# Altium schematic sheet tailLite.SchDoc
size 584 x 635 mm; SheetNumber: 1; SheetTotal: 1; ENG_APP_DATE: --/--/--; DSN_APP_DATE: --/--/--; CHK_APP_DATE: --/--/--
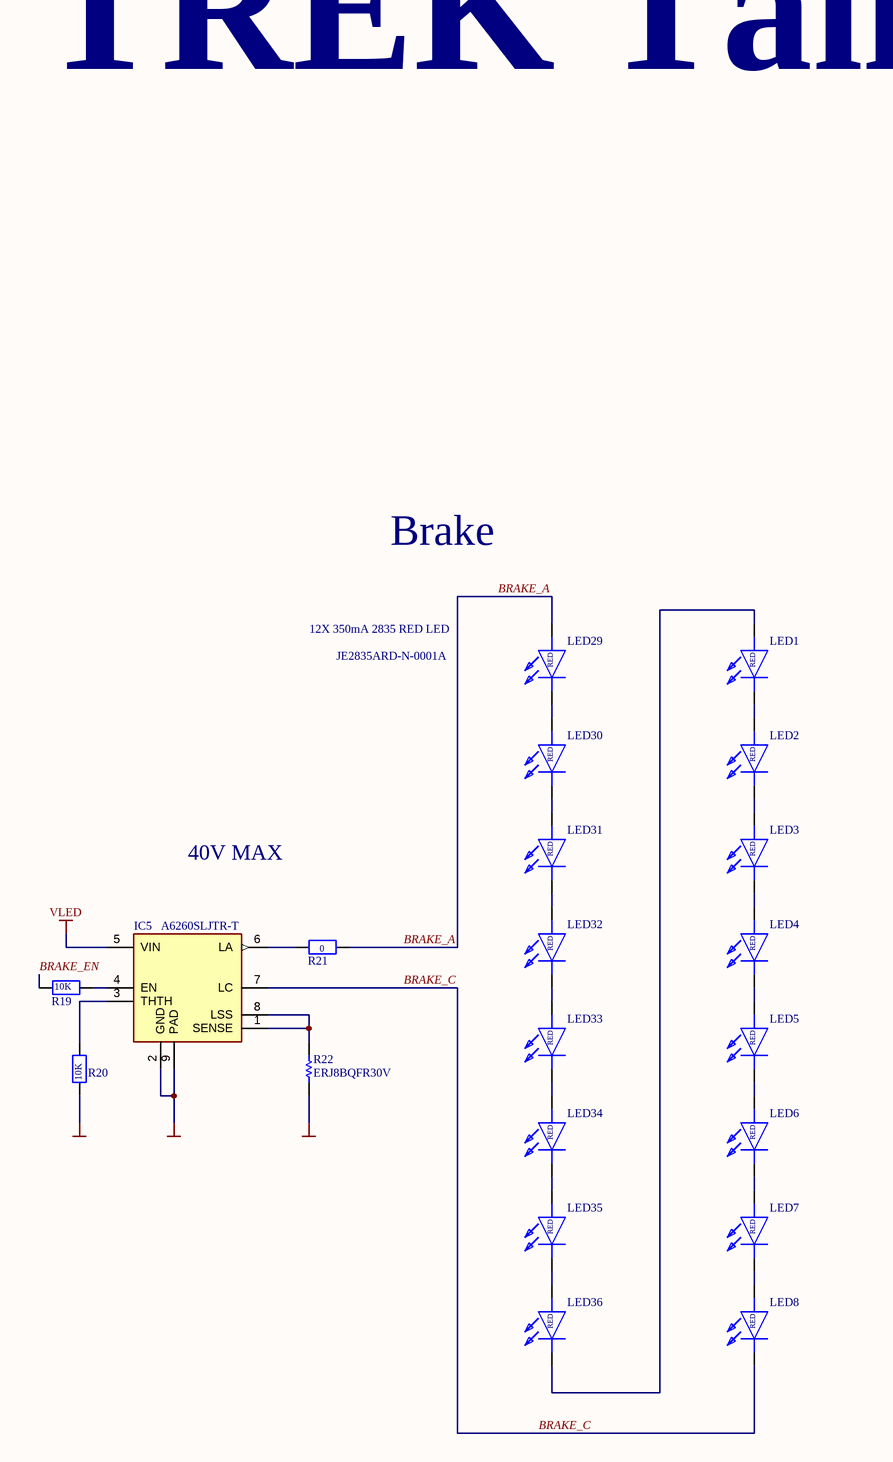
[diagram p0: tailLite.SchDoc, top left]
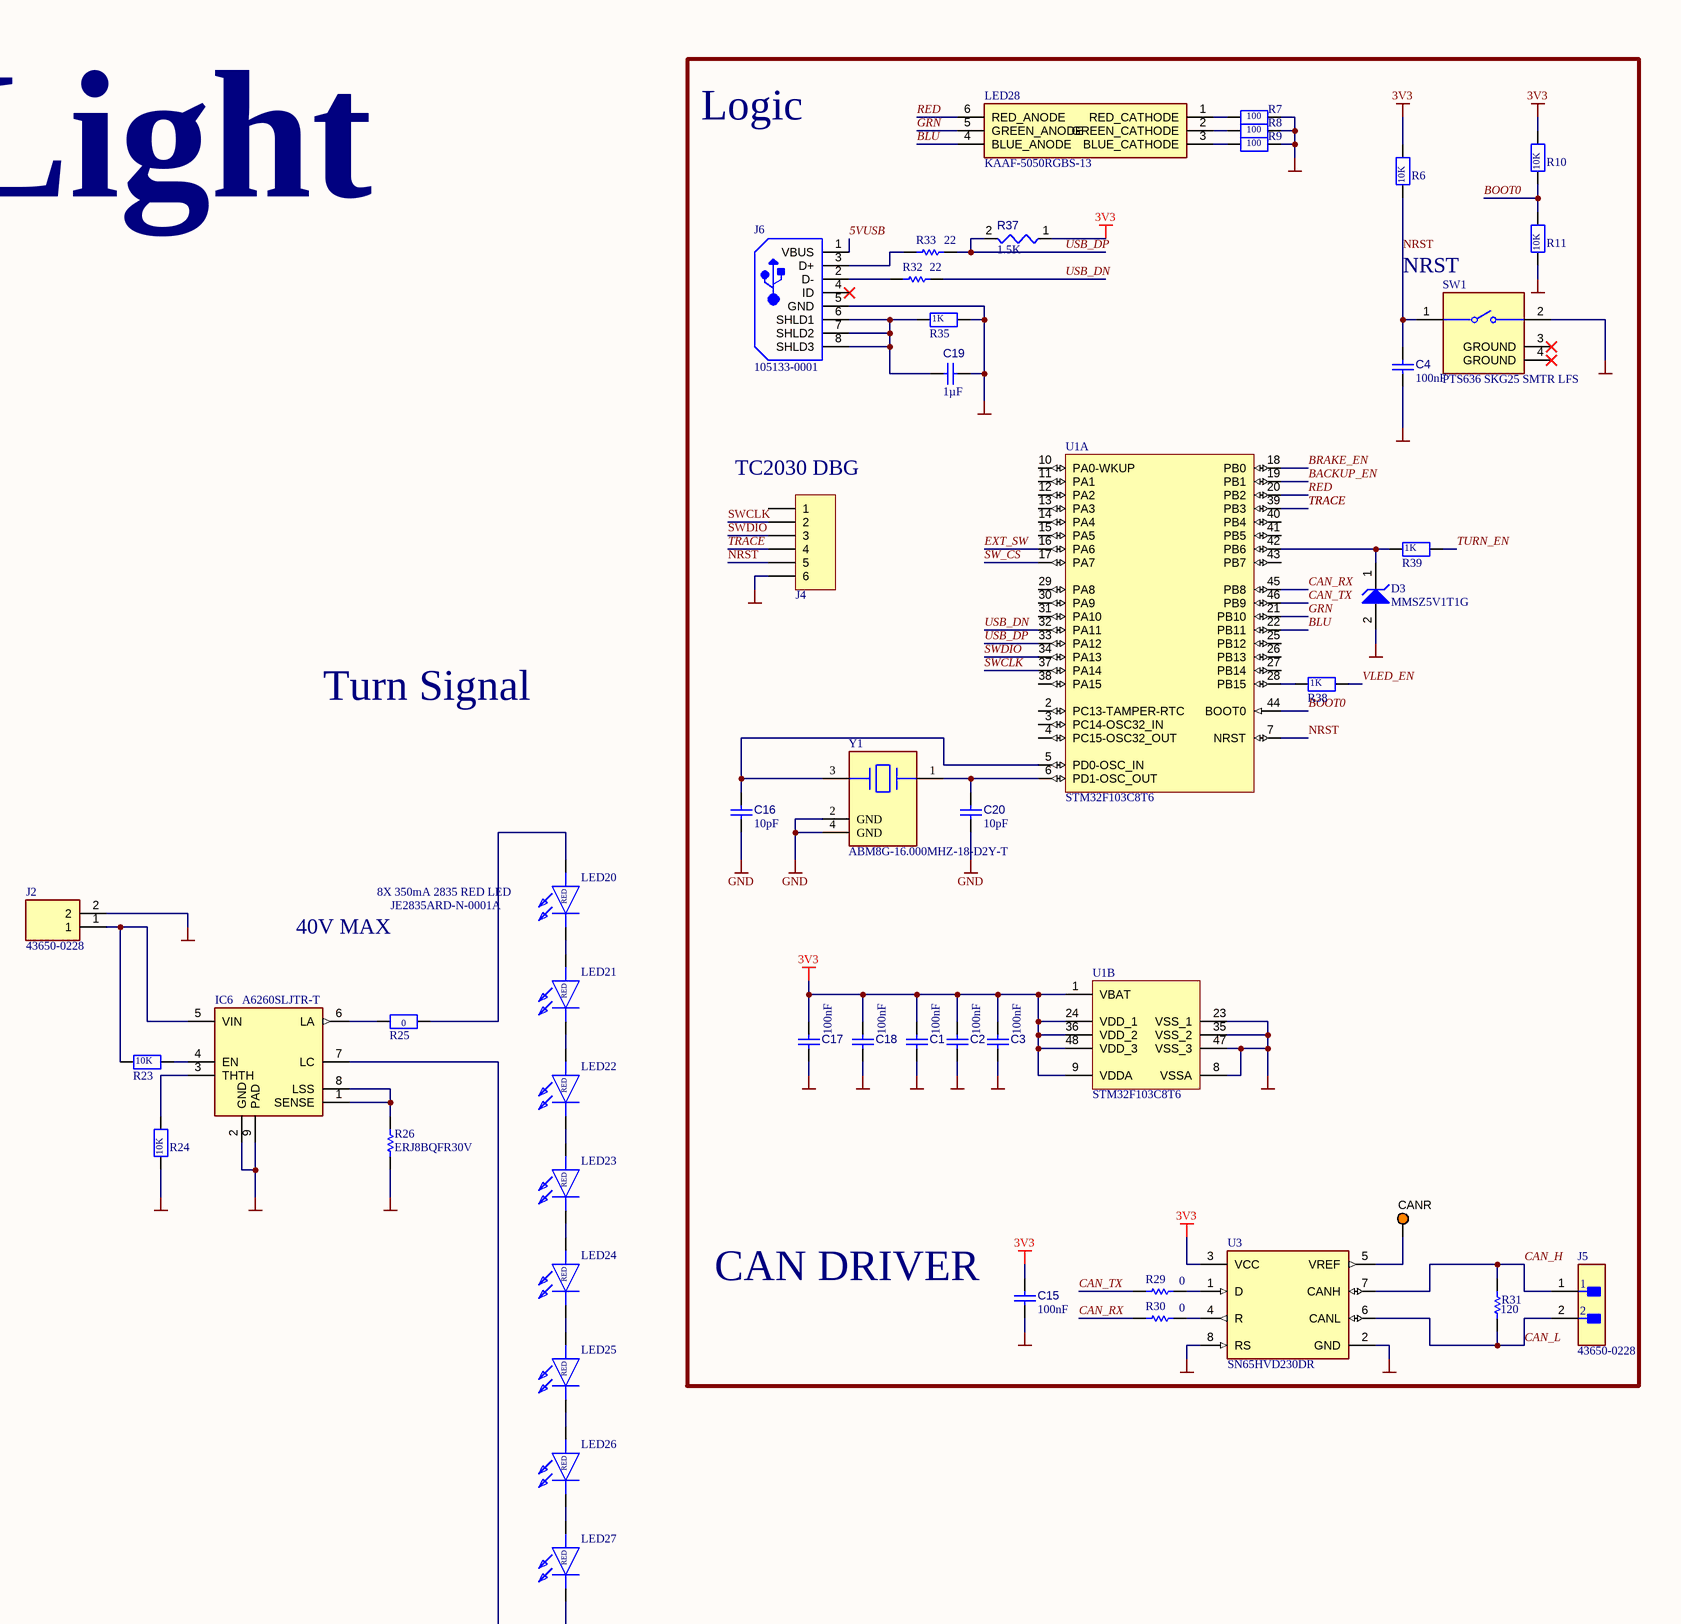
[diagram p1: tailLite.SchDoc, top right]
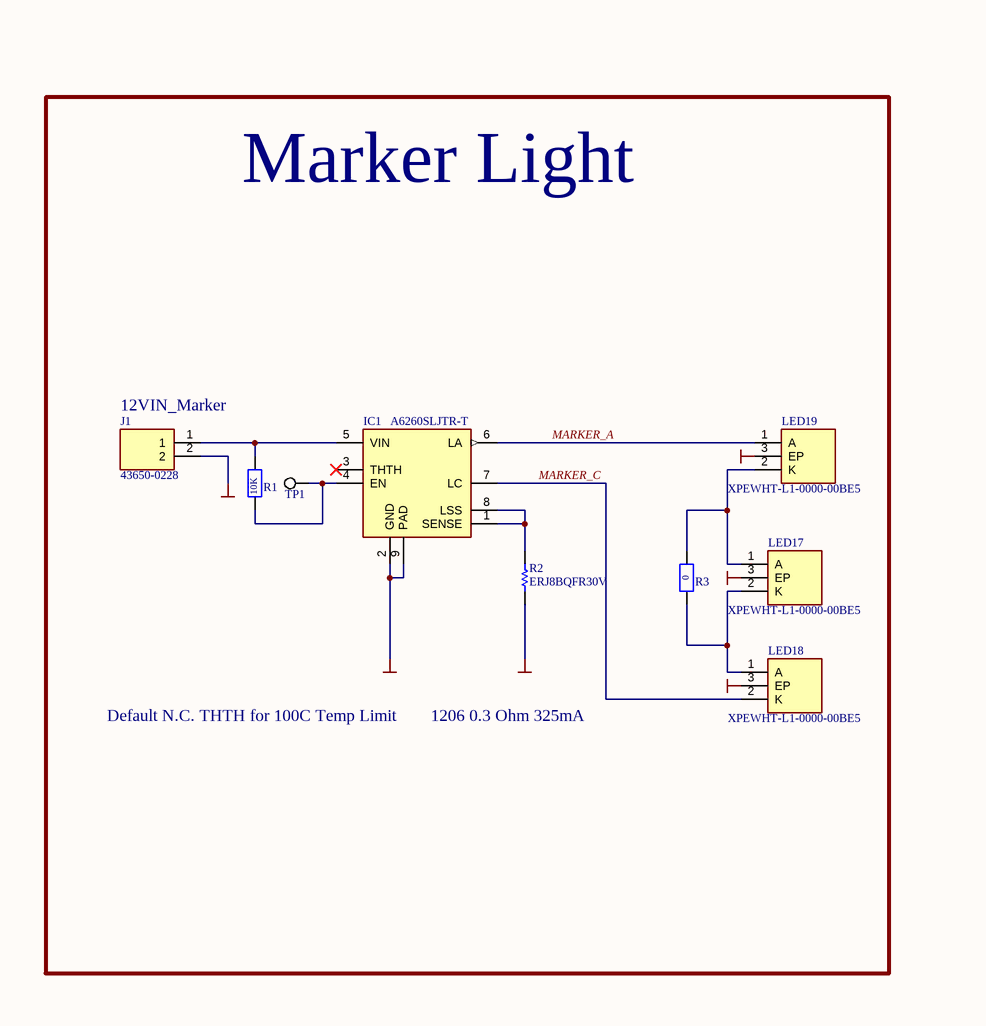
[diagram p2: tailLite.SchDoc, bottom left]
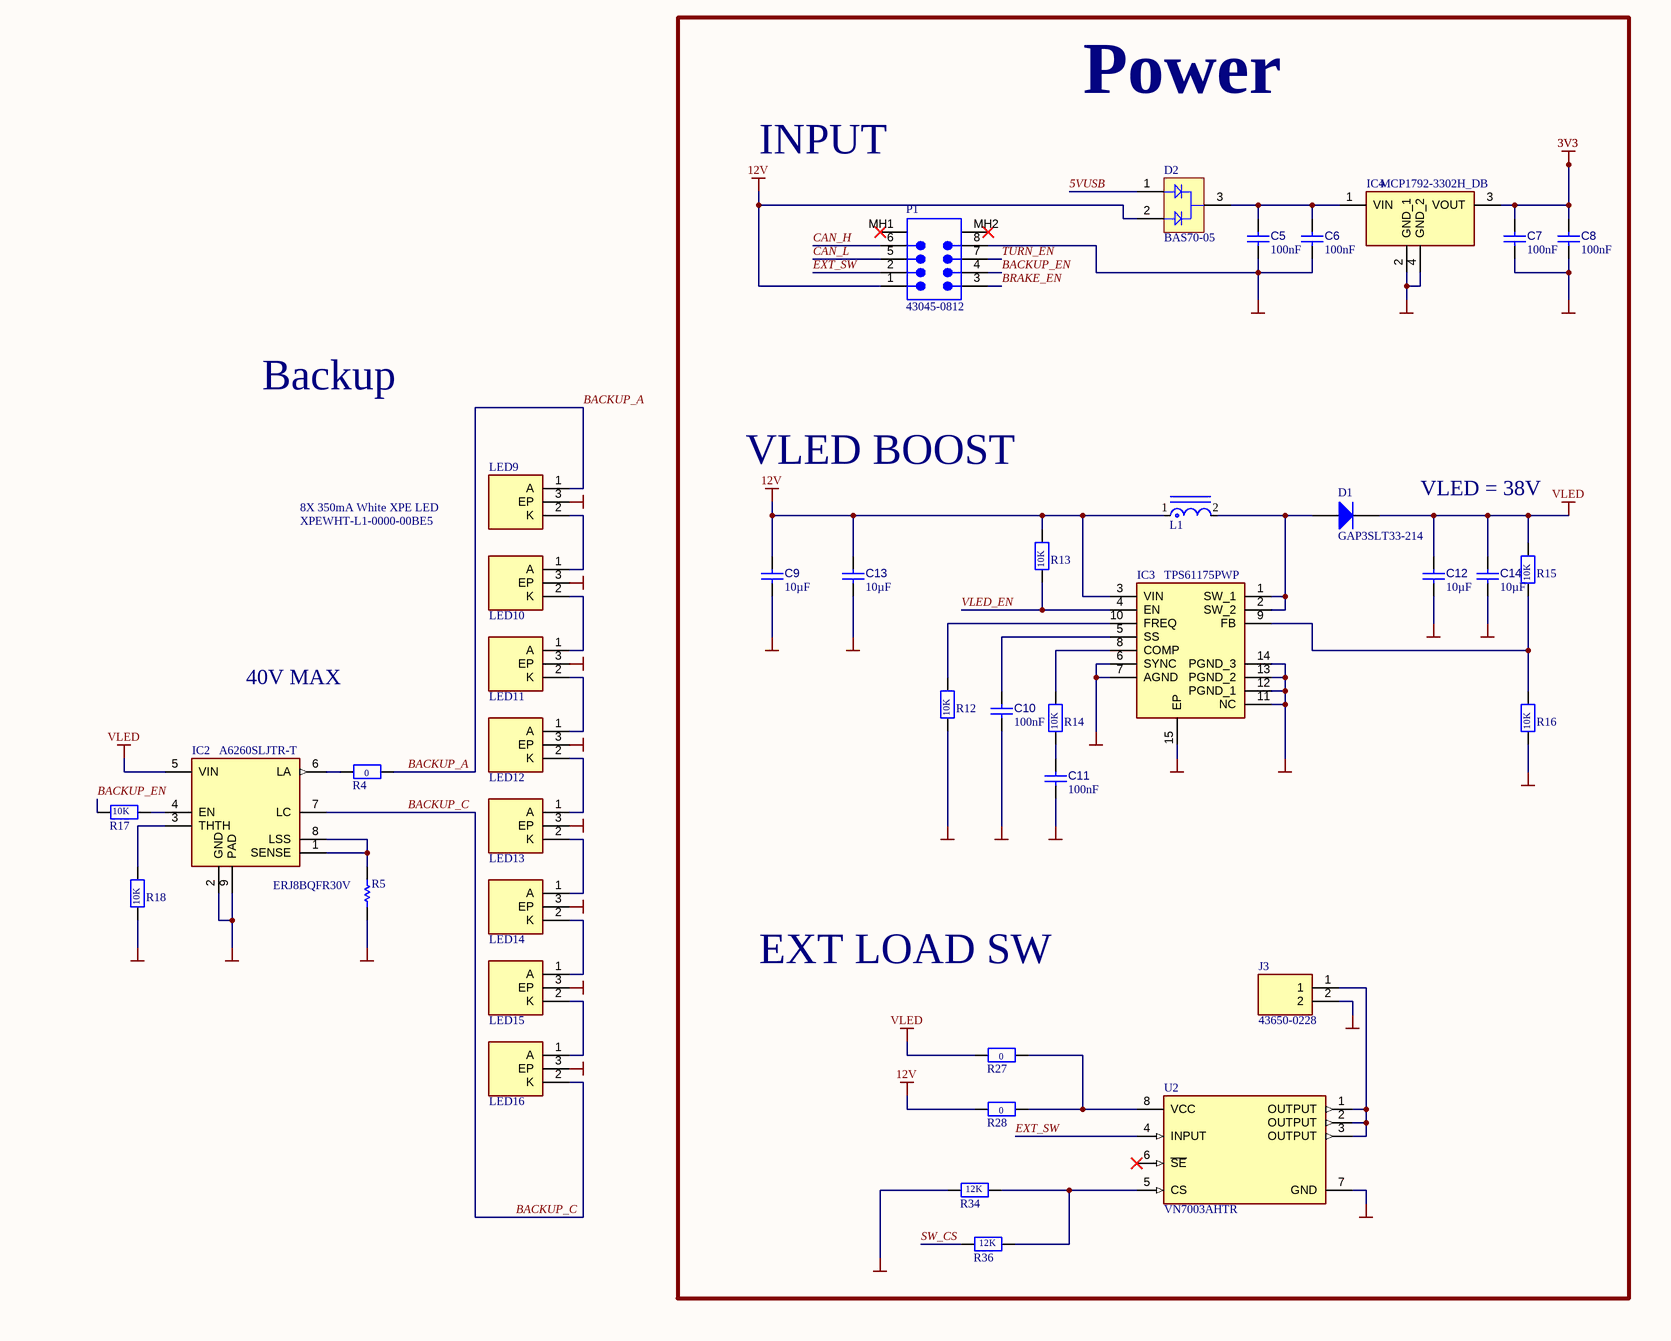
[diagram p3: tailLite.SchDoc, bottom right]

## Parts
C1  value 100nF  [CAPC1608X90X40NL10T20]  (hidden comment: Capacitor 100 nF +/-10% 50 V 0603)
C2  value 100nF  [CAPC1608X90X40NL10T20]  (hidden comment: Capacitor 100 nF +/-10% 50 V 0603)
C3  value 100nF  [CAPC1608X90X40NL10T20]  (hidden comment: Capacitor 100 nF +/-10% 50 V 0603)
C4  value 100nF  [CAPC1608X90X40NL10T20]  (hidden comment: Capacitor 100 nF +/-10% 50 V 0603)
C5  value 100nF  [CAPC1608X90X40NL10T20]  (hidden comment: Capacitor 100 nF +/-10% 50 V 0603)
C6  value 100nF  [CAPC1608X90X40NL10T20]  (hidden comment: Capacitor 100 nF +/-10% 50 V 0603)
C7  value 100nF  [CAPC1608X90X40NL10T20]  (hidden comment: Capacitor 100 nF +/-10% 50 V 0603)
C8  value 100nF  [CAPC1608X90X40NL10T20]  (hidden comment: Capacitor 100 nF +/-10% 50 V 0603)
C9  value 10µF  [CAPC3216X180X50NL20T25]  (hidden comment: Capacitor 10 uF +/- 10% 16 V 1206)
C10  value 100nF  [CAPC1608X90X40NL10T20]  (hidden comment: Capacitor 100 nF +/-10% 50 V 0603)
C11  value 100nF  [CAPC1608X90X40NL10T20]  (hidden comment: Capacitor 100 nF +/-10% 50 V 0603)
C12  value 10µF  [CAPC3216X180X50NL20T25]  (hidden comment: Capacitor 10 uF +/- 10% 16 V 1206)
C13  value 10µF  [CAPC3216X180X50NL20T25]  (hidden comment: Capacitor 10 uF +/- 10% 16 V 1206)
C14  value 10µF  [CAPC3216X180X50NL20T25]  (hidden comment: Capacitor 10 uF +/- 10% 16 V 1206)
C15  value 100nF  [CAPC1608X90X40NL10T20]  (hidden comment: Capacitor 100 nF +/-10% 50 V 0603)
C16  value 10pF  [CAPC1608X87X35NL15T15]  (hidden comment: Capacitor 10 pF +/- 0.25 pF 50 V 0603)
C17  value 100nF  [CAPC1608X90X40NL10T20]  (hidden comment: Capacitor 100 nF +/-10% 50 V 0603)
C18  value 100nF  [CAPC1608X90X40NL10T20]  (hidden comment: Capacitor 100 nF +/-10% 50 V 0603)
C19  value 1µF  [CAPC1608X90X35ML15T15]  (hidden comment: Capacitor 1uF +/- 10% 16V 0603)
C20  value 10pF  [CAPC1608X87X35NL15T15]  (hidden comment: Capacitor 10 pF +/- 0.25 pF 50 V 0603)
CANR  5003  [KSTN-5003]  (value not drawn)
D1  GAP3SLT33-214  [GESC-GAP3SLT33-214-2_V]
D2  BAS70-05  [INF-SOT23_N]
D3  MMSZ5V1T1G  [ONSC-SOD-123-2-425-04_V]
IC1  A6260SLJTR-T  [SOIC127P600X170-9N]
IC2  A6260SLJTR-T  [SOIC127P600X170-9N]
IC3  TPS61175PWP  [SOP65P640X120-15N]
IC4  MCP1792-3302H_DB  [SOT230P700X180-4N]
IC5  A6260SLJTR-T  [SOIC127P600X170-9N]
IC6  A6260SLJTR-T  [SOIC127P600X170-9N]
J1  43650-0228  [43650-02YY_272829]
J2  43650-0228  [43650-02YY_272829]
J3  43650-0228  [43650-02YY_272829]
J4  ICSP  [TC2030-MCP-NL]  (value not drawn)
J5  43650-0228  [FP-43650-0228-MFG]
J6  105133-0001  [MOLX-105133-0001_V]
L1  HCM0703-3R3-R  [FP-HCM0703-MFG]  (value not drawn)
LED1  JE2835ARD-N-0001A  [JE2835ARDN0001A0000N0000001]  (value not drawn)
LED2  JE2835ARD-N-0001A  [JE2835ARDN0001A0000N0000001]  (value not drawn)
LED3  JE2835ARD-N-0001A  [JE2835ARDN0001A0000N0000001]  (value not drawn)
LED4  JE2835ARD-N-0001A  [JE2835ARDN0001A0000N0000001]  (value not drawn)
LED5  JE2835ARD-N-0001A  [JE2835ARDN0001A0000N0000001]  (value not drawn)
LED6  JE2835ARD-N-0001A  [JE2835ARDN0001A0000N0000001]  (value not drawn)
LED7  JE2835ARD-N-0001A  [JE2835ARDN0001A0000N0000001]  (value not drawn)
LED8  JE2835ARD-N-0001A  [JE2835ARDN0001A0000N0000001]  (value not drawn)
LED9  XPEWHT-L1-0000-00BE5  [XPEWHTL1000000BE5]
LED10  XPEWHT-L1-0000-00BE5  [XPEWHTL1000000BE5]  (value not drawn)
LED11  XPEWHT-L1-0000-00BE5  [XPEWHTL1000000BE5]  (value not drawn)
LED12  XPEWHT-L1-0000-00BE5  [XPEWHTL1000000BE5]  (value not drawn)
LED13  XPEWHT-L1-0000-00BE5  [XPEWHTL1000000BE5]  (value not drawn)
LED14  XPEWHT-L1-0000-00BE5  [XPEWHTL1000000BE5]  (value not drawn)
LED15  XPEWHT-L1-0000-00BE5  [XPEWHTL1000000BE5]  (value not drawn)
LED16  XPEWHT-L1-0000-00BE5  [XPEWHTL1000000BE5]  (value not drawn)
LED17  XPEWHT-L1-0000-00BE5  [XPEWHTL1000000BE5]
LED18  XPEWHT-L1-0000-00BE5  [XPEWHTL1000000BE5]
LED19  XPEWHT-L1-0000-00BE5  [XPEWHTL1000000BE5]
LED20  JE2835ARD-N-0001A  [JE2835ARDN0001A0000N0000001]
LED21  JE2835ARD-N-0001A  [JE2835ARDN0001A0000N0000001]  (value not drawn)
LED22  JE2835ARD-N-0001A  [JE2835ARDN0001A0000N0000001]  (value not drawn)
LED23  JE2835ARD-N-0001A  [JE2835ARDN0001A0000N0000001]  (value not drawn)
LED24  JE2835ARD-N-0001A  [JE2835ARDN0001A0000N0000001]  (value not drawn)
LED25  JE2835ARD-N-0001A  [JE2835ARDN0001A0000N0000001]  (value not drawn)
LED26  JE2835ARD-N-0001A  [JE2835ARDN0001A0000N0000001]  (value not drawn)
LED27  JE2835ARD-N-0001A  [JE2835ARDN0001A0000N0000001]  (value not drawn)
LED28  KAAF-5050RGBS-13  [KAAF-5050RGBS-13]
LED29  JE2835ARD-N-0001A  [JE2835ARDN0001A0000N0000001]
LED30  JE2835ARD-N-0001A  [JE2835ARDN0001A0000N0000001]  (value not drawn)
LED31  JE2835ARD-N-0001A  [JE2835ARDN0001A0000N0000001]  (value not drawn)
LED32  JE2835ARD-N-0001A  [JE2835ARDN0001A0000N0000001]  (value not drawn)
LED33  JE2835ARD-N-0001A  [JE2835ARDN0001A0000N0000001]  (value not drawn)
LED34  JE2835ARD-N-0001A  [JE2835ARDN0001A0000N0000001]  (value not drawn)
LED35  JE2835ARD-N-0001A  [JE2835ARDN0001A0000N0000001]  (value not drawn)
LED36  JE2835ARD-N-0001A  [JE2835ARDN0001A0000N0000001]  (value not drawn)
P1  43045-0812  [MOLX-43045-0812_V]
R1  0603_10K  [RESC1609X55X30ML15T15]  (value not drawn)
R2  ERJ8BQFR30V  [RESC3216X70X50LL05T20]
R3  0603_0ohm  [RESC1609X55X30ML15T15]  (value not drawn)
R4  0603_0ohm  [RESC1609X55X30ML15T15]  (value not drawn)
R5  ERJ8BQFR30V  [RESC3216X70X50LL05T20]
R6  0603_10K  [RESC1609X55X30ML15T15]  (value not drawn)
R7  0603_100ohm  [RESC1609X55X30ML15T15]  (value not drawn)
R8  0603_100ohm  [RESC1609X55X30ML15T15]  (value not drawn)
R9  0603_100ohm  [RESC1609X55X30ML15T15]  (value not drawn)
R10  0603_10K  [RESC1609X55X30ML15T15]  (value not drawn)
R11  0603_10K  [RESC1609X55X30ML15T15]  (value not drawn)
R12  0603_10K  [RESC1609X55X30ML15T15]  (value not drawn)
R13  0603_10K  [RESC1609X55X30ML15T15]  (value not drawn)
R14  0603_10K  [RESC1609X55X30ML15T15]  (value not drawn)
R15  0603_10K  [RESC1609X55X30ML15T15]  (value not drawn)
R16  0603_10K  [RESC1609X55X30ML15T15]  (value not drawn)
R17  0603_10K  [RESC1609X55X30ML15T15]  (value not drawn)
R18  0603_10K  [RESC1609X55X30ML15T15]  (value not drawn)
R19  0603_10K  [RESC1609X55X30ML15T15]  (value not drawn)
R20  0603_10K  [RESC1609X55X30ML15T15]  (value not drawn)
R21  0603_0ohm  [RESC1609X55X30ML15T15]  (value not drawn)
R22  ERJ8BQFR30V  [RESC3216X70X50LL05T20]
R23  0603_10K  [RESC1609X55X30ML15T15]  (value not drawn)
R24  0603_10K  [RESC1609X55X30ML15T15]  (value not drawn)
R25  0603_0ohm  [RESC1609X55X30ML15T15]  (value not drawn)
R26  ERJ8BQFR30V  [RESC3216X70X50LL05T20]
R27  0603_0ohm  [RESC1609X55X30ML15T15]  (value not drawn)
R28  0603_0ohm  [RESC1609X55X30ML15T15]  (value not drawn)
R29  Resistance: 0  [RESC1609X55X30LL15T15]  (hidden comment: ERJ3EKF1002V)
R30  Resistance: 0  [RESC1609X55X30LL15T15]  (hidden comment: ERJ3EKF1002V)
R31  Resistance: 120  [RESC1609X55X30LL15T15]  (hidden comment: ERJ3EKF1002V)
R32  Resistance: 22  [RESC1609X55X30LL15T15]  (hidden comment: ERJ3EKF1002V)
R33  Resistance: 22  [RESC1609X55X30LL15T15]  (hidden comment: ERJ3EKF1002V)
R34  0603_12K  [RESC1609X55X30ML15T15]  (value not drawn)
R35  0603_1K  [RESC1609X55X30ML15T15]  (value not drawn)
R36  0603_12K  [RESC1609X55X30ML15T15]  (value not drawn)
R37  value 1.5K  [RESC1608X55X25ML10T15]  (hidden comment: Resistor 10k +/-1% 0603 100 mW)
R38  0603_1K  [RESC1609X55X30ML15T15]  (value not drawn)
R39  0603_1K  [RESC1609X55X30ML15T15]  (value not drawn)
SW1  PTS636 SKG25 SMTR LFS  [FP-PTS636_SKG25_SMTR_LFS-MFG]
TP1  5019  [KSTN-5019_V]  (value not drawn)
U1  STM32F103C8T6  [STM-LQFP48_M]  (parts A,B of 2)
U2  VN7003AHTR  [FP-Octapak-GAPGCFT00665-IPC_A]
U3  SN65HVD230DR  [FP-D0008A-IPC_A]
Y1  ABM8G-16.000MHZ-18-D2Y-T  [FP-ABM8G-MFG]

## Blocks framed on the sheet
Power: C5-C14 D1 D2 IC3 IC4 J3 L1 P1 R12-R16 R27 R28 R34 R36 U2
Marker Light: IC1 J1 LED17-LED19 R1-R3 TP1

## Nets
3V3: C1.2 C2.2 C3.2 C7.2 C8.2 C15.1 C17.2 C18.2 IC4.3(VOUT) R6.2 R10.2 R37.1 U1.1(VBAT) U1.9(VDDA) U1.24(VDD_1) U1.36(VDD_2) U1.48(VDD_3) U3.3(VCC)
12V: C9.2 C13.2 D2.2(A2) IC3.3(VIN) L1.1 P1.1 R13.2 R28.2
GND: C1.1 C2.1 C3.1 C4.1 C5.1 C6.1 C7.1 C8.1 C9.1 C10.1 C11.1 C12.1 C13.1 C14.1 C15.2 C16.2 C17.1 C18.1 C19.2 C20.2 D3.2(A) IC1.2(GND) IC1.9(PAD) IC2.2(GND) IC2.9(PAD) IC3.6(SYNC) IC3.7(AGND) IC3.11(NC) IC3.12(PGND_1) IC3.13(PGND_2) IC3.14(PGND_3) IC3.15(EP) IC4.2(GND_1) IC4.4(GND_2) IC5.2(GND) IC5.9(PAD) IC6.2(GND) IC6.9(PAD) J1.2 J2.2 J3.2 J4.6 J6.5(GND) LED9.3(EP) LED10.3(EP) LED11.3(EP) LED12.3(EP) LED13.3(EP) LED14.3(EP) LED15.3(EP) LED16.3(EP) LED17.3(EP) LED18.3(EP) LED19.3(EP) P1.8 R2.1 R5.1 R7.2 R8.2 R9.2 R11.1 R12.1 R16.1 R18.1 R20.1 R22.1 R24.1 R26.1 R34.1 R35.2 SW1.2 U1.8(VSSA) U1.23(VSS_1) U1.35(VSS_2) U1.47(VSS_3) U2.7(GND) U3.2(GND) U3.8(RS) Y1.2(GND) Y1.4(GND)
VLED: C12.2 C14.2 D1.2(K) IC2.5(VIN) IC5.5(VIN) R15.2 R27.2
5VUSB: D2.1(A1) J6.1(VBUS)
BACKUP_A: LED9.1(A) R4.1
BACKUP_C: IC2.7(LC) LED16.2(K)
BACKUP_EN: P1.4 R17.1 U1.19(PB1)
BLU: LED28.4(BLUE_ANODE) U1.22(PB11)
BOOT0: R10.1 R11.2 U1.44(BOOT0)
BRAKE_A: LED29.1(A) R21.1
BRAKE_C: IC5.7(LC) LED8.2(K)
BRAKE_EN: P1.3 R19.1 U1.18(PB0)
CAN_H: J5.1 P1.6 R31.2 U3.7(CANH)
CAN_L: J5.2 P1.5 R31.1 U3.6(CANL)
CAN_RX: R30.2 U1.45(PB8)
CAN_TX: R29.2 U1.46(PB9)
EXT_SW: P1.2 U1.16(PA6) U2.4(INPUT)
GRN: LED28.5(GREEN_ANODE) U1.21(PB10)
MARKER_A: IC1.6(LA) LED19.1(A)
MARKER_C: IC1.7(LC) LED18.2(K)
NRST: C4.2 J4.5 R6.1 SW1.1 U1.7(NRST)
RED: LED28.6(RED_ANODE) U1.20(PB2)
SW_CS: R36.1 U1.17(PA7)
SWCLK: J4.2 U1.37(PA14)
SWDIO: J4.3 U1.34(PA13)
TRACE: J4.4 U1.39(PB3)
TURN_EN: P1.7 R39.2
USB_DN: R32.1 U1.32(PA11)
USB_DP: R33.1 R37.2 U1.33(PA12)
VLED_EN: IC3.4(EN) R13.1 R38.2
NetC5_2: C5.2 C6.2 D2.3(K) IC4.1(VIN)
NetC10_2: C10.2 IC3.5(SS)
NetC11_2: C11.2 R14.1
NetC16_1: C16.1 U1.5(PD0-OSC_IN) Y1.3
NetC19_1: C19.1 J6.6(SHLD1) J6.7(SHLD2) J6.8(SHLD3) R35.1
NetC20_1: C20.1 U1.6(PD1-OSC_OUT) Y1.1
NetCANR_1: CANR.1 U3.5(VREF)
NetD1_1: D1.1(A) IC3.1(SW_1) IC3.2(SW_2) L1.2
NetD3_1: D3.1(K) R39.1 U1.42(PB6)
NetIC1_1: IC1.1(SENSE) IC1.8(LSS) R2.2
NetIC1_4: IC1.4(EN) R1.1 TP1.1
NetIC1_5: IC1.5(VIN) J1.1 R1.2
NetIC2_1: IC2.1(SENSE) IC2.8(LSS) R5.2
NetIC2_3: IC2.3(THTH) R18.2
NetIC2_4: IC2.4(EN) R17.2
NetIC2_6: IC2.6(LA) R4.2
NetIC3_8: IC3.8(COMP) R14.2
NetIC3_9: IC3.9(FB) R15.1 R16.2
NetIC3_10: IC3.10(FREQ) R12.2
NetIC5_1: IC5.1(SENSE) IC5.8(LSS) R22.2
NetIC5_3: IC5.3(THTH) R20.2
NetIC5_4: IC5.4(EN) R19.2
NetIC5_6: IC5.6(LA) R21.2
NetIC6_1: IC6.1(SENSE) IC6.8(LSS) R26.2
NetIC6_3: IC6.3(THTH) R24.2
NetIC6_4: IC6.4(EN) R23.2
NetIC6_5: IC6.5(VIN) J2.1 R23.1
NetIC6_6: IC6.6(LA) R25.2
NetIC6_7: IC6.7(LC) LED27.2(K)
NetJ3_1: J3.1 U2.1(OUTPUT) U2.2(OUTPUT) U2.3(OUTPUT)
NetJ6_2: J6.2(D-) R32.2
NetJ6_3: J6.3(D+) R33.2
NetLED1_1: LED1.1(A) LED36.2(K)
NetLED1_2: LED1.2(K) LED2.1(A)
NetLED2_2: LED2.2(K) LED3.1(A)
NetLED3_2: LED3.2(K) LED4.1(A)
NetLED4_2: LED4.2(K) LED5.1(A)
NetLED5_2: LED5.2(K) LED6.1(A)
NetLED6_2: LED6.2(K) LED7.1(A)
NetLED7_2: LED7.2(K) LED8.1(A)
NetLED9_2: LED9.2(K) LED10.1(A)
NetLED10_2: LED10.2(K) LED11.1(A)
NetLED11_2: LED11.2(K) LED12.1(A)
NetLED12_2: LED12.2(K) LED13.1(A)
NetLED13_2: LED13.2(K) LED14.1(A)
NetLED14_2: LED14.2(K) LED15.1(A)
NetLED15_2: LED15.2(K) LED16.1(A)
NetLED17_1: LED17.1(A) LED19.2(K) R3.2
NetLED17_2: LED17.2(K) LED18.1(A) R3.1
NetLED20_1: LED20.1(A) R25.1
NetLED20_2: LED20.2(K) LED21.1(A)
NetLED21_2: LED21.2(K) LED22.1(A)
NetLED22_2: LED22.2(K) LED23.1(A)
NetLED23_2: LED23.2(K) LED24.1(A)
NetLED24_2: LED24.2(K) LED25.1(A)
NetLED25_2: LED25.2(K) LED26.1(A)
NetLED26_2: LED26.2(K) LED27.1(A)
NetLED28_1: LED28.1(RED_CATHODE) R7.1
NetLED28_2: LED28.2(GREEN_CATHODE) R8.1
NetLED28_3: LED28.3(BLUE_CATHODE) R9.1
NetLED29_2: LED29.2(K) LED30.1(A)
NetLED30_2: LED30.2(K) LED31.1(A)
NetLED31_2: LED31.2(K) LED32.1(A)
NetLED32_2: LED32.2(K) LED33.1(A)
NetLED33_2: LED33.2(K) LED34.1(A)
NetLED34_2: LED34.2(K) LED35.1(A)
NetLED35_2: LED35.2(K) LED36.1(A)
NetR27_1: R27.1 R28.1 U2.8(VCC)
NetR29_1: R29.1 U3.1(D)
NetR30_1: R30.1 U3.4(R)
NetR34_2: R34.2 R36.2 U2.5(CS)
NetR38_1: R38.1 U1.28(PB15)

Not connected (* = marked no-connect by the designer): IC1 3(THTH)*; J4 1; J6 4(ID)*; P1 MH1* MH2*; SW1 3(GROUND)* 4(GROUND)*; U1 2(PC13-TAMPER-RTC) 3(PC14-OSC32_IN) 4(PC15-OSC32_OUT) 10(PA0-WKUP) 11(PA1) 12(PA2) 13(PA3) 14(PA4) 15(PA5) 25(PB12) 26(PB13) 27(PB14) 29(PA8) 30(PA9) 31(PA10) 38(PA15) 40(PB4) 41(PB5) 43(PB7); U2 6(~{SE})*

## Notes on the sheet
- Logic
- TREK Tail Light
- (near SW1) NRST
- (near J4) TC2030 DBG
- Brake
- Turn Signal
- 12X 350mA 2835 RED LED
- 8X 350mA 2835 RED LED
- 40V MAX
- CAN DRIVER
- INPUT
- Backup
- VLED BOOST
- 8X 350mA White XPE LED
- VLED = 38V
- (near J1) 12VIN_Marker
- EXT LOAD SW
- Default N.C. THTH for 100C Temp Limit
- 1206 0.3 Ohm 325mA
- DWG. NO.
- REV.
- SHT.
- THIS DOCUMENT AND THE DATA DISCLOSED HEREIN OR HEREWITH IS THE PROPERTY OF ALTIUM LIMITED AND MAY BE FREELY DISTRIBUTED IN WHOLE. NO RIGHTS ARE RESERVED OR EXPRESS OR IMPLIED WARANTEE GIVEN.
- REVISION
- DESCRIPTION
- DATE
- APPROVED
- ENG:
- APPROVALS
- PROJECT
- DSN:
- CHK:
- REFERENCE DOCUMENTS
- PROJECT REVISION:
- TITLE
- DOCUMENT REVISION:
- DESIGN ITEM:
- BOM:
- FAB DWG:
- PCB DWG:
- ASSY DWG:
- SCALE:
- SIZE
- B
- CAGE CODE
- FILE NAME
- DWG NO.
- SHEET
- OF
- REV
- (in symbol CMP-007-00036-1) RED
- (in symbol CMP-009-00178-1) 10K
- (in symbol CMP-009-00182-1) 0
- (in symbol CMP-009-00183-1) 100
- (in symbol CMP-009-00185-1) 1K
- (in symbol CMP-009-00189-1) 12K

## Library data of the parts
C1-C8 C10 C11 C15 C17 C18 = CMP-001-00017-7: Chip Capacitor, 100 nF, +/- 10%, 50 V, 0603 (1608 Metric); Voltage Rating: 50V; Capacitor Type: Ceramic; Mounting Technology: SM; Pins: 2; Tolerance: 10%; Case/Package: 0603; Min Operating Temperature: -55°C; Max Operating Temperature: 125°C; RoHS Compliant: True
C9 C12-C14 = CMP-001-00016-7: Chip Capacitor, 10 uF, +/- 10%, 16 V, 1206 (3216 Metric); Capacitor Type: Ceramic; Voltage Rating: 16V; RoHS Compliant: True; Max Operating Temperature: 125°C; Tolerance: 10%; Case/Package: 1206; Mounting Technology: SM; Pins: 2; Min Operating Temperature: -55°C
C16 C20 = CMP-001-00012-7: Chip Capacitor, 10 pF, +/- 0.25 pF, 50 V, 0603 (1608 Metric); Tolerance: 0.25%; Capacitor Type: Ceramic; Voltage Rating: 50V; Max Operating Temperature: 125°C; RoHS Compliant: True; Mounting Technology: SM; Pins: 2; Case/Package: 0603; Min Operating Temperature: -55°C
C19 = CMP-001-00004-7: Chip Capacitor, 1 uF, +/- 10%, 16 V, 0603 (1608 Metric); Capacitor Type: Ceramic; Mounting Technology: SM; RoHS Compliant: True; Min Operating Temperature: -55°C; Case/Package: 0603; Pins: 2; Voltage Rating: 16V; Max Operating Temperature: 125°C; Tolerance: 10%
CANR = CMP-002-00037-2: Test Point, Orange, Height 4.6 mm, Tail Length 3 mm, 1-Pin THD, RoHS; Manufacturer: Keystone; Colour: Orange; Packaging: Bulk; Package Description: 1-Pin Through Hole Device, Dia 2.54 mm; Pins: 1; Package Reference: 5003; Datasheet Version: Jun-15; Case/Package: 5003; Mounting Technology: TH; Connector Type: TestPoint; Diameter: 2.54mm; Contact Material: Bronze; Datasheet URL: http://keyelco.com/userAssets/file/M65p56.pdf; Manufacturer URL: http://www.keyelco.com/; Package Quantity: 10; Contact Plating: Tin; RoHS Compliant: True
D1 = CMP-2000-05135-2: Silicon Carbide Power Schottky Diode, 3300 V, - 0.3 A, -55 to 175 degC, 2-Pin SMD, RoHS, Tape and Reel; Pd - Power Dissipation: 25W; Configuration: Single; Vrrm - Repetitive Reverse Voltage: 3300V; Unit Weight: 0.003284oz; trr - Reverse Recovery time: 60ns; Brand: GeneSiCSemiconductor; Package Version: Rev. 1, 11/2013; Ir - Reverse Current: 100uA; Ifsm - Forward Surge Current: 10A; Vf - Forward Voltage: 4V; If - Forward Current: 0.3A; Product: SchottkySiliconCarbideDiodes; Maximum Operating Temperature: +175C; RoHS: True; Packaging: Reel; Datasheet URL: https://datasheet.ciiva.com/24141/gap3slt33-214-271329-24141300.pdf; Minimum Operating Temperature: -55C; Package URL: https://datasheet.ciiva.com/24141/gap3slt33-214-271329-24141300.pdf; Factory Pack Quantity: 2500; Package Description: 2-Pin Chip, Body 4.57 x 3.94 mm; Package / Case: DO-214AA; Mounting Style: SMD/SMT; Operating Temperature Range: -55Cto+175C; Manufacturer: GeneSiCSemiconductor; Datasheet Version: Rev. 1, 11/2013; Technology: SiC; Product Category: SchottkyDiodes&Rectifiers; Manufacturer URL: http://www.genesicsemi.com/; Series: GAP3SLT33
D2 = CMP-004-00033-1: Rectifier Diode Schottky Si 0.07A Automotive 3-Pin SOT-23 T/R
D3 = CMP-004-00034-1: Zener Diode Single 5.1V 5% 60Ohm 500mW 2-Pin SOD-123 T/R
IC1 IC2 IC5 IC6 = A6260SLJTR-T: Integrated Circuit; Manufacturer_Name: Allegro Microsystems; Datasheet Link: https://componentsearchengine.com/Datasheets/2/A6260SLJTR-T.pdf; Height: 1.7mm; Manufacturer_Part_Number: A6260SLJTR-T; Arrow Part Number: A6260SLJTR-T; Arrow Price/Stock: https://www.arrow.com/en/products/a6260sljtr-t/allegro-microsystems
IC3 = TPS61175PWP: Integrated Circuit; Manufacturer_Name: Texas Instruments; Datasheet Link: https://datasheet.datasheetarchive.com/originals/distributors/SFDatasheet-6/sf-000124651.pdf; Height: 1.2mm; Manufacturer_Part_Number: TPS61175PWP; Mouser Part Number: 595-TPS61175PWP; Mouser Price/Stock: https://www.mouser.co.uk/ProductDetail/Texas-Instruments/TPS61175PWP?qs=7IaIRco65pkcG6%252BABCkf6A%3D%3D; Arrow Part Number: TPS61175PWP; Arrow Price/Stock: https://www.arrow.com/en/products/tps61175pwp/texas-instruments?region=nac
IC4 = CMP-013-000004-1: LDO Voltage Regulators High input voltage regulator 3.3V 3Ld SOT-223; Manufacturer_Name: Microchip; Manufacturer_Part_Number: MCP1792-3302H/DB; Arrow Price/Stock: https://www.arrow.com/en/products/mcp1792-3302hdb/microchip-technology?region=nac; Source: SamacSys.SchLib; Arrow Part Number: MCP1792-3302H/DB; Height: 1.8mm; Design Item ID: MCP1792-3302H_DB; Mouser Price/Stock: https://www.mouser.co.uk/ProductDetail/Microchip-Technology/MCP1792-3302H-DB?qs=mAH9sUMRCttoG5iLrM6fSg%3D%3D; Datasheet Link: http://ww1.microchip.com/downloads/en/DeviceDoc/MCP1792-Family-Data-Sheet-DS20006229C.pdf; Mouser Part Number: 579-MCP1792-3302HDB
J1-J3 = 43650-0228: Connector; Manufacturer_Name: Molex; Datasheet Link: https://www.molex.com/pdm_docs/sd/436500227_sd.pdf; Height: 9.9mm; Manufacturer_Part_Number: 43650-0228; Mouser Part Number: 538-43650-0228; Mouser Price/Stock: https://www.mouser.co.uk/ProductDetail/Molex/43650-0228?qs=zhePCb1yaFP6JU2H4NgbnQ%3D%3D
J4 = CMP-008-000000-2: Design Item ID: ICSP; Component Type: Standard; Source: TC2030.SchLib; Pin Count: 5
J5 = CMP-04776-000607-1: CONN HEADER VERT 2POS 3MM; Number of Positions: 2; Glow Wire Compliant: Compliant; Voltage Rating: 250V; Current Rating: 5A; Package Quantity: 3264; Halogen Free: Low Halogen; Number of Rows: 1; Housing Material: Thermoplastic; Packaging: Tray; Contact Material: Brass; Series: 43650; Termination: Through Hole; Contact Plating: Gold; Pitch: 3mm; Orientation: Vertical; RoHS Compliant: Yes; Number of Circuits: 2
J6 = CMP-002-00073-1: Conn Micro USB 2.0 Type B RCP 5 POS 0.65mm Solder ST SMD 5 Terminal 1 Port Micro-USB T/R
L1 = CMP-006-00022-1: Inductor Power Shielded Wirewound 3.3uH/1.98uH 20% 100KHz Powdered Iron 6A 30mOhm DCR T/R
LED1-LED8 LED20-LED27 LED29-LED36 = CMP-007-00036-1: LED Lighting Color J Red-Orange 615nm (610nm ~ 620nm) 1411 (3528 Metric); Manufacturer_Part_Number: JE2835ARD-N-0001A0000-N0000001; Manufacturer_Name: CREE LED; Height: 0.8mm; Arrow Price/Stock: https://www.arrow.com/en/products/je2835ard-n-0001a0000-n0000001/cree-led?region=nac; Design Item ID: JE2835ARD-N-0001A0000-N0000001; Arrow Part Number: JE2835ARD-N-0001A0000-N0000001; Mouser Price/Stock: https://www.mouser.co.uk/ProductDetail/Cree-LED/JE2835ARD-N-0001A0000-N0000001?qs=tlsG%2FOw5FFi%2FF9M49gTwyg%3D%3D; Mouser Part Number: 941-JE2835ARDN01AN; Datasheet Link: https://cree-led.com/media/documents/JSeries-2835-Color_1.pdf; Source: SamacSys.SchLib
LED9-LED19 = CMP-014-000000-1: LED; Manufacturer_Name: Wolfspeed; Datasheet Link: https://www.cree.com/led-components/media/documents/XLampXPE.pdf; Height: 2.13mm; Mouser Price/Stock: https://www.mouser.com/Search/Refine.aspx?Keyword=941-XPEWHTL100BE5; Design Item ID: XPEWHT-L1-0000-00BE5; Arrow Price/Stock: https://www.arrow.com/en/products/xpewht-l1-0000-00be5/cree; Arrow Part Number: XPEWHT-L1-0000-00BE5; Manufacturer_Part_Number: XPEWHT-L1-0000-00BE5; Mouser Part Number: 941-XPEWHTL100BE5; Source: SamacSys.SchLib
LED28 = KAAF-5050RGBS-13: LED; Manufacturer_Name: Kingbright; Datasheet Link: http://datasheet.octopart.com/KAAF-5050RGBS-13-Kingbright-datasheet-62316414.pdf; Manufacturer_Part_Number: KAAF-5050RGBS-13; Mouser Part Number: N/A; Mouser Price/Stock: https://www.mouser.co.uk/ProductDetail/Kingbright/KAAF-5050RGBS-13?qs=8qEfIxKlfRnmc9WrrJNiQg%3D%3D
P1 = CMP-1594-00003-1: 3 mm Pitch Micro-Fit 3.0 Connector, 17.27 mm Mated Height, Vertical, Through Hole, 8 Circuits, -40 to 105 degC, RoHS, Tray; Pitch: 3 mm; No. of Positions: 8; No. of Rows: 2; ComponentLink2Description: Datasheet; ComponentLink2URL: http://www.molex.com/webdocs/datasheets/pdf/en-us/0430450812_PCB_HEADERS.pdf; Orientation: Vertical; PartNumber: 43045-0812; Packing: Tray; Temperature Min: -40 degC; RoHS: TRUE; ComponentLink3Description: Package Specification; Temperature Max: 105 degC; ComponentLink3URL: http://www.molex.com/pdm_docs/sd/430450812_sd.pdf; Mounting Technology: Through Hole; PackageVersion: Rev. F, 06/2009; ComponentLink1Description: Manufacturer URL; PackageDescription: 8-Pin PCB Header, Vertical, Pitch 3 mm, Mated Height 17.27 mm, Through Hole; ComponentLink1URL: http://www.molex.com/
R1 R6 R10-R20 R23 R24 = CMP-009-00178-1: SMD Chip Resistor, 1.67 kohm, ± 1%, 100 mW, 0603 [1608 Metric], Thick Film, Precision
R2 R5 R22 R26 = CMP-2003-00750-1: Manufacturer: Panasonic; Part Number: ERJ8BQFR30V
R3 R4 R21 R25 R27 R28 = CMP-009-00182-1: SMD Chip Resistor, 0ohm, ± 1%, 100 mW, 0603 [1608 Metric], Thick Film, Precision
R7-R9 = CMP-009-00183-1: SMD Chip Resistor, 100 ohm, ± 1%, 100 mW, 0603 [1608 Metric], Thick Film, Precision
R29-R33 = CMP-1012-00623-3: Chip Resistor, 10 KOhm, +/- 1%, 0.1 W, -55 to 155 degC, 0603 (1608 Metric), RoHS, Tape and Reel; Manufacturer: Panasonic; Voltage Rating: 75V; Case\/Package: 0603; Power Rating: 100mW; Temperature Coefficient: 100ppm\/degreesC; Number of Pins: 2; Package Reference: 603; Depth: 0.8mm; Mount: SurfaceMount; Package Description: 2-Pin Surface Mount Device, Body 1.6 x 0.85 mm; Datasheet Version: 02/2017; Length: 1.6mm; Lead Free: LeadFree; Height: 0.45mm; Number of Terminations: 2; Max Power Dissipation: 100mW; Min Operating Temperature: -55degC; Datasheet URL: https://industrial.panasonic.com/cdbs/www-data/pdf/RDA0000/AOA0000C304.pdf; Termination: SMD/SMT; Case Code (Metric): 1608; Case Code (Imperial): 0603; Tolerance: 1%; Max Operating Temperature: 155degC; RoHSCompliant: true; Voltage Rating (DC): 75V; Radiation Hardening: No; Packaging: TapeandReel; Composition: ThickFilm; Mounting Technology: SurfaceMount; Manufacturer URL: http://www.panasonic.com/; Width: 0.031inch; REACH SVHC: NoSVHC; Contact Plating: Tin; Military Standard: Not; Package Quantity: 1
R34 R36 = CMP-009-00189-1: SMD Chip Resistor, 12 kohm, ± 1%, 100 mW, 0603 [1608 Metric], Thick Film, Precision
R35 R38 R39 = CMP-009-00185-1: SMD Chip Resistor, 1 kohm, ± 1%, 100 mW, 0603 [1608 Metric], Thick Film, Precision
R37 = CMP-009-00017-5: Chip Resistor, 10 KOhm, +/- 1%, 01 W, -55 to 155 degC, 0603 (1608 Metric); Voltage Rating: 50V; Power: 100mW; RoHS Compliant: True; Min Operating Temperature: -55°C; Pins: 2; Case/Package: 0603; Mounting Technology: SM; Max Operating Temperature: 155°C; Tolerance: 1%
SW1 = CMP-10040-000025-1: TACT 6.0 X 3.5, 2.5 MM H, 250GF,
TP1 = CMP-1672-00008-1: Test Point, 1 Position SMD, RoHS, Tape and Reel; ComponentLink1Description: Manufacturer URL; Package Quantity: 1000; DatasheetVersion: 03/2014; Packaging: Tape and Reel; ComponentLink2URL: http://www.keyelco.com/product-pdf.cfm?p=1357; ComponentLink1URL: http://www.keyelco.com/; Mount: Surface Mount; Contact Plating: Silver; PackageDescription: 1-Pin Surface Mount Device, Body 3.81 x 2.03 mm; Pins: 1; RoHSCompliant: True; Mounting Technology: Surface Mount; ComponentLink2Description: Datasheet; PackageReference: 5019
U1 = CMP-00000-1: IC MCU 32BIT 64KB FLASH 48LQFP; Oscillator Type: Internal; Watchdog Timer: Yes; Number of ADC Channels: 10; Clock Frequency: 72MHz; Interface: I2C,SPI,USB,CAN,USART; Number of Timers/Counters: 3; Address Bus Width: 32b; Number of PWM Channels: 1; Peripherals: POR,PWM,WDT,DMA,Temp Sensor,I2C; Max Supply Voltage: 3.6V; Number of Programmable I/O: 48; Number of Bits: 32; Number of I/Os: 37; Number of SPI Channels: 2; Core Architecture: ARM; RAM Size: 20KB; Max Power Dissipation: 363mW; Min Supply Voltage: 2V; Height: 1.4mm; Memory Size: 64KB; Packaging: Tray; Width: 7mm; Series: STM32F103C8; Pins: 48; Reach SVHC Compliant: Yes; Weight: 0.006349oz; Radiation Hardening: No; Termination: SMD/SMT; Case/Package: LQFP; Lead Free: Lead Free; Data Bus Width: 32b; RoHS Compliant: Yes; Length: 7mm; Memory Format: FLASH; Number of I2C Channels: 2; Min Operating Temperature: -40°C; Density: 64KB; Frequency: 72MHz; Package Quantity: 1500; Max Operating Temperature: 85°C
U2 = CMP-001-0000-1: High-side driver with Current Sense analog feedback for automotive applications
U3 = CMP-0315-00015-3: IC TRANSCEIVER HALF 1/1 8SOIC; Number of Transceivers: 1; Operating Supply Voltage: 3.3V; Number of I/Os: 2; Max Supply Current: 17mA; Max Supply Voltage: 3.6V; Min Supply Voltage: 3V; Data Rate: 1Mbps; Min Operating Temperature: -40°C; Packaging: Tape and Reel; Lead Free: Lead Free; Number of Transmit Buffers: 1; Max Operating Temperature: 85°C; Number of Receive Buffers: 1; Number of Pins: 8; Package Quantity: 1; Radiation Hardening: No; Case/Package: D; REACH SVHC: No SVHC; Weight: 0.002561oz; Termination: SMD/SMT; Contact Plating: Gold; Nominal Supply Current: 17mA; Number of Receivers: 1; Number of Drivers: 1
Y1 = CMP-27762-006537-2: Crystal 16MHz ±20ppm (Tol) ±30ppm (Stability) 18pF FUND 80Ω 4-Pin SMD T/R; Series Resistance: 80R; Radiation Hardening: No; Load Capacitance: 18pF; Package Quantity: 1000; Frequency Stability: 30ppm; ESR (Equivalent Series Resistance): 80R; Depth: 2.5mm; Height: 1mm; Number of Pins: 4; Frequency Tolerance: 20ppm; Frequency: 16MHz; Tolerance: 20ppm; Min Operating Temperature: -40°C; Length: 3.2mm; Termination: SMD/SMT; Max Operating Temperature: 85°C; Width: 2.5mm; Series: ABM8G; Mount: Surface Mount; Case/Package: CSMD; Lead Free: Lead Free; Operating Frequency: 16 MHz; Packaging: Tape and Reel